# Altium schematic sheet Leds.SchDoc
size A4
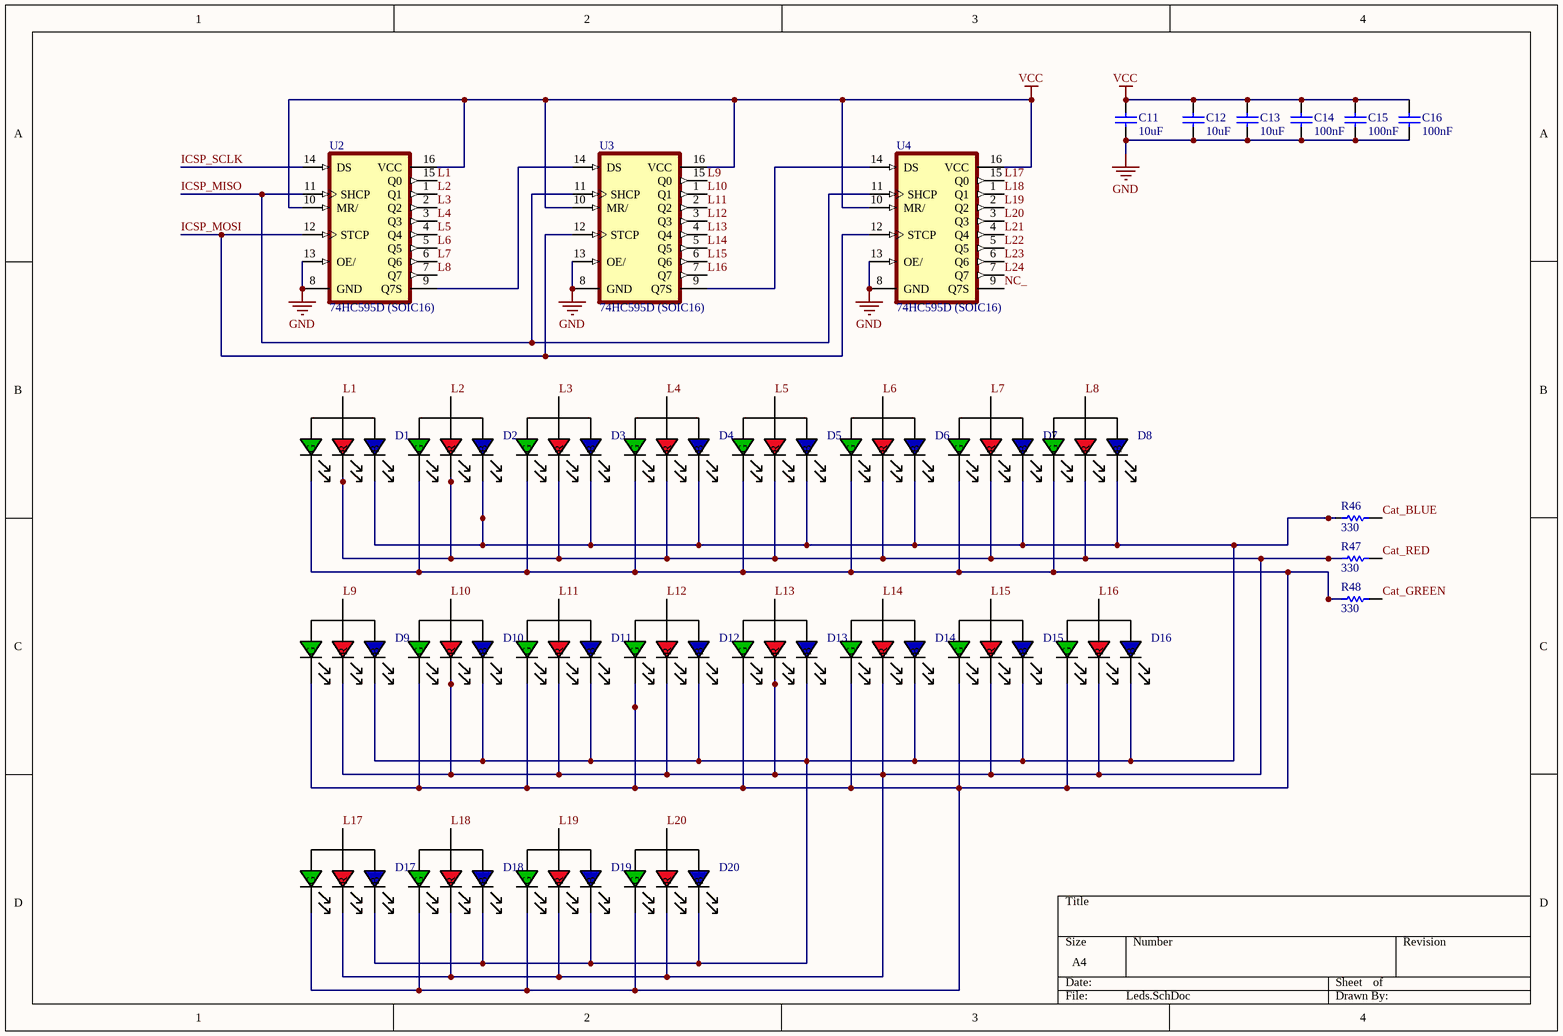
[diagram p0: Leds.SchDoc]

## Parts
C11  10uF  [0603]
C12  10uF  [0603]
C13  10uF  [0603]
C14  100nF  [0603]
C15  100nF  [0603]
C16  100nF  [0603]
D1  RGB LED CLEAR  [RADIAL 4 LEADS]  (value not drawn)
D2  RGB LED CLEAR  [RADIAL 4 LEADS]  (value not drawn)
D3  RGB LED CLEAR  [RADIAL 4 LEADS]  (value not drawn)
D4  RGB LED CLEAR  [RADIAL 4 LEADS]  (value not drawn)
D5  RGB LED CLEAR  [RADIAL 4 LEADS]  (value not drawn)
D6  RGB LED CLEAR  [RADIAL 4 LEADS]  (value not drawn)
D7  RGB LED CLEAR  [RADIAL 4 LEADS]  (value not drawn)
D8  RGB LED CLEAR  [RADIAL 4 LEADS]  (value not drawn)
D9  RGB LED CLEAR  [RADIAL 4 LEADS]  (value not drawn)
D10  RGB LED CLEAR  [RADIAL 4 LEADS]  (value not drawn)
D11  RGB LED CLEAR  [RADIAL 4 LEADS]  (value not drawn)
D12  RGB LED CLEAR  [RADIAL 4 LEADS]  (value not drawn)
D13  RGB LED CLEAR  [RADIAL 4 LEADS]  (value not drawn)
D14  RGB LED CLEAR  [RADIAL 4 LEADS]  (value not drawn)
D15  RGB LED CLEAR  [RADIAL 4 LEADS]  (value not drawn)
D16  RGB LED CLEAR  [RADIAL 4 LEADS]  (value not drawn)
D17  RGB LED CLEAR  [RADIAL 4 LEADS]  (value not drawn)
D18  RGB LED CLEAR  [RADIAL 4 LEADS]  (value not drawn)
D19  RGB LED CLEAR  [RADIAL 4 LEADS]  (value not drawn)
D20  RGB LED CLEAR  [RADIAL 4 LEADS]  (value not drawn)
R46  value 330  [0603]  (hidden comment: RESISTOR GENERIC)
R47  value 330  [0603]  (hidden comment: RESISTOR GENERIC)
R48  value 330  [0603]  (hidden comment: RESISTOR GENERIC)
U2  74HC595D (SOIC16)  [SOIC16-1.27-10X3.9MM]
U3  74HC595D (SOIC16)  [SOIC16-1.27-10X3.9MM]
U4  74HC595D (SOIC16)  [SOIC16-1.27-10X3.9MM]

## Nets
GND: C11.1 C12.1 C13.1 C14.1 C15.1 C16.1 U2.8(GND) U2.13(OE/) U3.8(GND) U3.13(OE/) U4.8(GND) U4.13(OE/)
VCC: C11.2 C12.2 C13.2 C14.2 C15.2 C16.2 U2.10(MR/) U2.16(VCC) U3.10(MR/) U3.16(VCC) U4.10(MR/) U4.16(VCC)
Cat_BLUE: R46.2
Cat_GREEN: R48.2
Cat_RED: R47.2
ICSP_MISO: U2.11(SHCP) U3.11(SHCP) U4.11(SHCP)
ICSP_MOSI: U2.12(STCP) U3.12(STCP) U4.12(STCP)
ICSP_SCLK: U2.14(DS)
L1: D1.2(Anode) U2.15(Q0)
L2: D2.2(Anode) U2.1(Q1)
L3: D3.2(Anode) U2.2(Q2)
L4: D4.2(Anode) U2.3(Q3)
L5: D5.2(Anode) U2.4(Q4)
L6: D6.2(Anode) U2.5(Q5)
L7: D7.2(Anode) U2.6(Q6)
L8: D8.2(Anode) U2.7(Q7)
L9: D9.2(Anode) U3.15(Q0)
L10: D10.2(Anode) U3.1(Q1)
L11: D11.2(Anode) U3.2(Q2)
L12: D12.2(Anode) U3.3(Q3)
L13: D13.2(Anode) U3.4(Q4)
L14: D14.2(Anode) U3.5(Q5)
L15: D15.2(Anode) U3.6(Q6)
L16: D16.2(Anode) U3.7(Q7)
L17: D17.2(Anode) U4.15(Q0)
L18: D18.2(Anode) U4.1(Q1)
L19: D19.2(Anode) U4.2(Q2)
L20: D20.2(Anode) U4.3(Q3)
L21: U4.4(Q4)
L22: U4.5(Q5)
L23: U4.6(Q6)
L24: U4.7(Q7)
NC_: U4.9(Q7S)
NetD1_1: D1.1(R) D2.1(R) D3.1(R) D4.1(R) D5.1(R) D6.1(R) D7.1(R) D8.1(R) D9.1(R) D10.1(R) D11.1(R) D12.1(R) D13.1(R) D14.1(R) D15.1(R) D16.1(R) D17.1(R) D18.1(R) D19.1(R) D20.1(R) R47.1
NetD1_3: D1.3(G) D2.3(G) D3.3(G) D4.3(G) D5.3(G) D6.3(G) D7.3(G) D8.3(G) D9.3(G) D10.3(G) D11.3(G) D12.3(G) D13.3(G) D14.3(G) D15.3(G) D16.3(G) D17.3(G) D18.3(G) D19.3(G) D20.3(G) R48.1
NetD1_4: D1.4(B) D2.4(B) D3.4(B) D4.4(B) D5.4(B) D6.4(B) D7.4(B) D8.4(B) D9.4(B) D10.4(B) D11.4(B) D12.4(B) D13.4(B) D14.4(B) D15.4(B) D16.4(B) D17.4(B) D18.4(B) D19.4(B) D20.4(B) R46.1
NetU2_9: U2.9(Q7S) U3.14(DS)
NetU3_9: U3.9(Q7S) U4.14(DS)

## Library data of the parts
C11-C13 = CAP 10uF 6.3V 20% 0603: Supplier 1: Digi-Key; Supplier Part Number 1: 1276-1119-1-ND
C14-C16 = CAP 100nF 10% 0603: Supplier 1: Digi-Key; Supplier 2: Digi-Key; Supplier Part Number 1: 399-1095-1-ND; Supplier Part Number 2: 311-1369-1-ND
D1-D20 = LED RGB TJ-L5FYTXHTCYLCRGB-AR: Mfr Part #: TJ-L5FYTXHTCYLCRGB-AR; LCSC Part #: C330749
U2-U4 = 74HC595D (SOIC16): Shift Shift Register 1 Element 8 Bit 16-SOP; MF: Toshiba; MP: 74HC595D; Price: None; SnapEDA_Link: https://www.snapeda.com/parts/74HC595D/avi/view-part/4713956/?ref=snap; Availability: Unavailable; Value: *; Package: SOP-16 Toshiba